# Altium project NANORACK_PHOTODIODE.PrjPcb
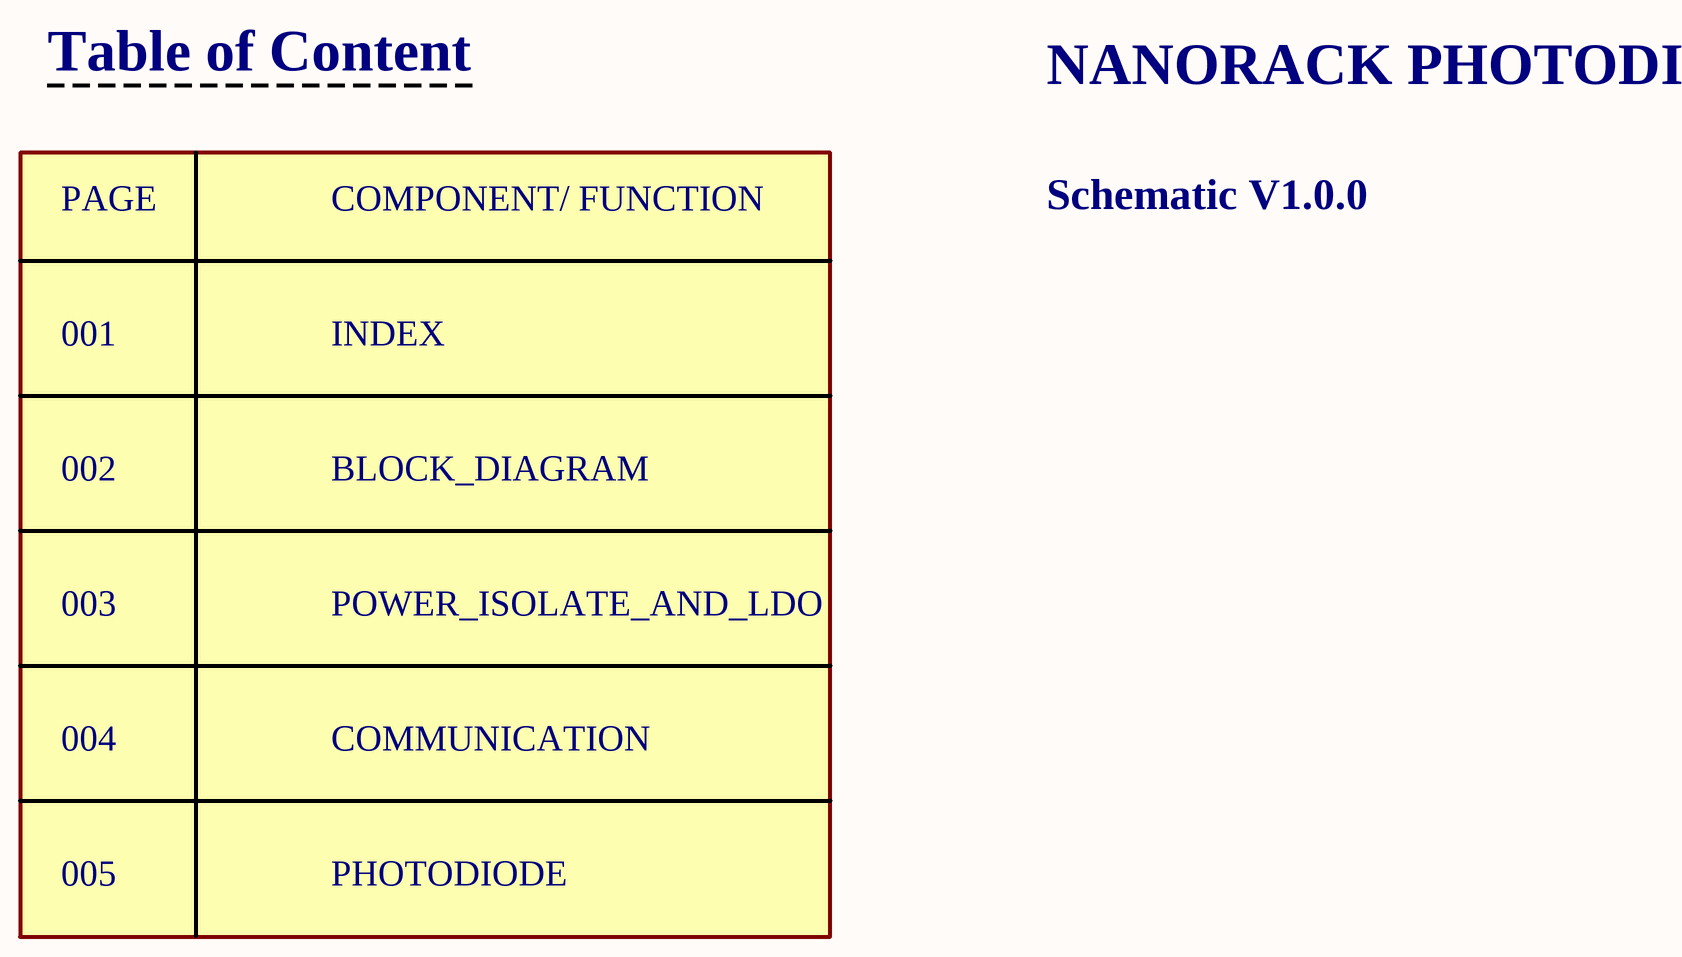
[diagram p0: INDEX.SchDoc]
5 sheets, 134 parts. Net scope: global (net labels, ports and power ports of the same name join across sheets).
Board file: PHOTODIODE_FIX.PcbDoc
Sheets:
  INDEX.SchDoc
  BLOCK_DIAGRAM.SchDoc
  POWER_ISOLATE_AND_LDO.SchDoc
  COMMUNICATION.SchDoc
  PHOTODIODE.SchDoc

## Sheet INDEX.SchDoc
size 420 x 297 mm; SheetNumber: 1; SheetTotal: 5

### Notes on the sheet
- Table of Content
- NANORACK PHOTODIODE
- PAGE
- COMPONENT/ FUNCTION
- Schematic V1.0.0
- 001
- INDEX
- 002
- BLOCK_DIAGRAM
- 003
- POWER_ISOLATE_AND_LDO
- 004
- COMMUNICATION
- 005
- PHOTODIODE
- Project:
- BEE-PC1
- Sub-system:
- Design by:
- Hung Nguyen D.
- Bao Bui Q.
- Sheet title:
- Sheet
- A3
- of
- Checked by:
- Approved by:
- Vu Pham
- Revision:
- Document No:
- V1.0.0
- Size:
- Date:

## Sheet BLOCK_DIAGRAM.SchDoc
size 420 x 297 mm; SheetNumber: 2; SheetTotal: 5

### Notes on the sheet
- Project:
- BEE-PC1
- Sub-system:
- Design by:
- Hung Nguyen D.
- Bao Bui Q.
- Sheet title:
- Sheet
- A3
- of
- Checked by:
- Approved by:
- Vu Pham
- Revision:
- Document No:
- V1.0.0
- Size:
- Date:
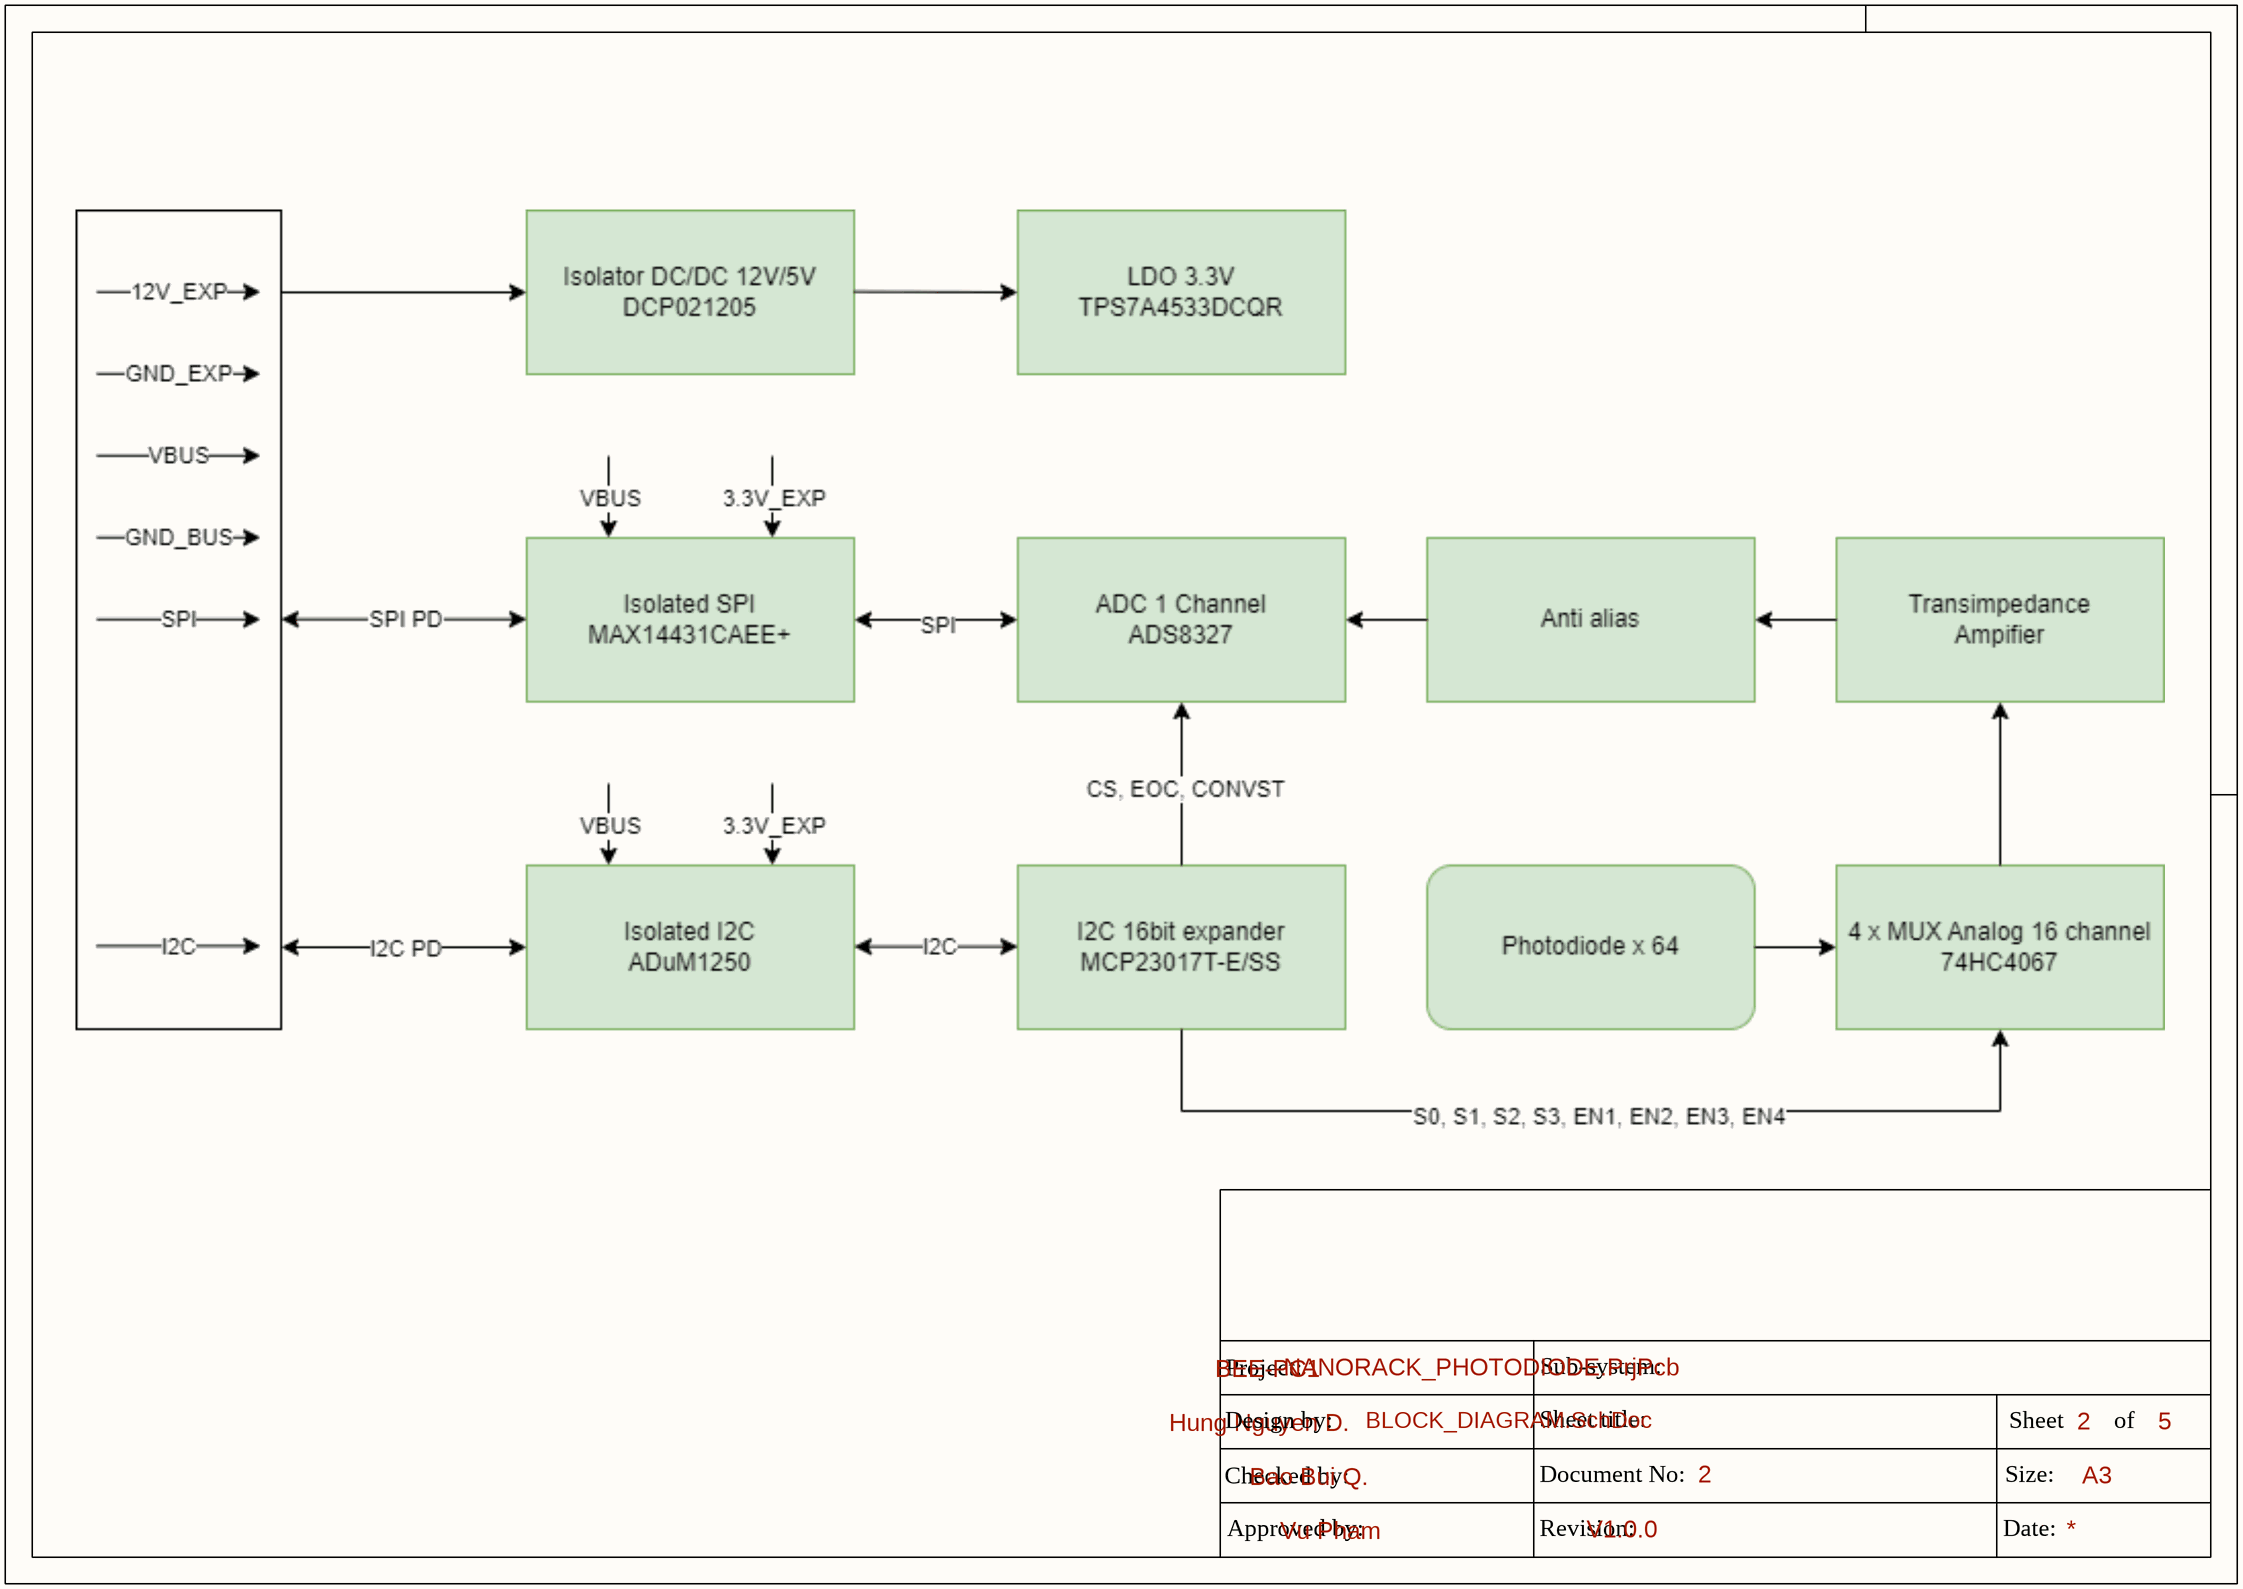
[diagram p1: BLOCK_DIAGRAM.SchDoc]

## Sheet POWER_ISOLATE_AND_LDO.SchDoc
size 420 x 297 mm; SheetNumber: 3; SheetTotal: 5
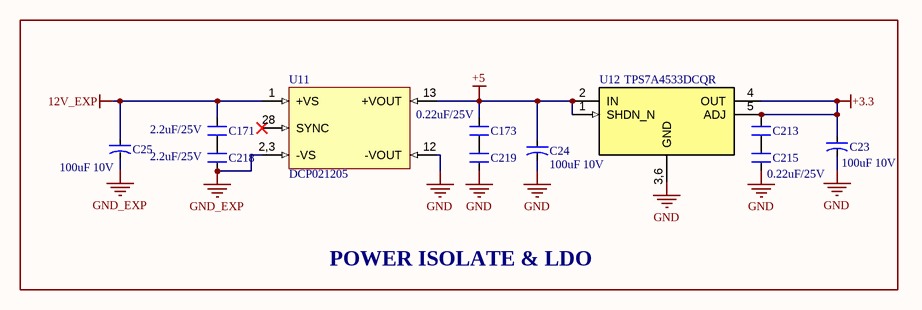
[diagram p2: POWER_ISOLATE_AND_LDO.SchDoc]

### Parts
C23  100uF 10V  [CAP_TANT_1206]
C24  100uF 10V  [CAP_TANT_1206]
C25  100uF 10V  [CAP_TANT_1206]
C171  2.2uF/25V  [SM-0603]
C173  0.22uF/25V  [SM-0603]
C213  0.22uF/25V  [SM-0603]  (value not drawn)
C215  0.22uF/25V  [SM-0603]
C218  2.2uF/25V  [SM-0603]
C219  0.22uF/25V  [SM-0603]  (value not drawn)
U11  DCP021205  [DCP02]
U12  TPS7A4533DCQR  [SOT223-6]

### Blocks framed on the sheet
POWER ISOLATE & LDO: C23-C25 C171 C173 C213 C215 C218 C219 U11 U12

### Nets
12V_EXP: C25.1 C171.2 U11.1(+VS)
+3.3: C23.1 C213.2 U12.4(OUT) U12.5(ADJ)
+5: C24.1 C173.2 U11.13(+VOUT) U12.1(SHDN_N) U12.2(IN)
GND: C23.2 C24.2 C215.1 C219.1 U11.12(-VOUT) U12.3,6(GND)
GND_EXP: C25.2 C218.1 U11.2,3(-VS)
NetC171_1: C171.1 C218.2
NetC173_1: C173.1 C219.2
NetC213_1: C213.1 C215.2

Not connected (* = marked no-connect by the designer): U11 28(SYNC)*

### Notes on the sheet
- Project:
- BEE-PC1
- Sub-system:
- Design by:
- Hung Nguyen D.
- Bao Bui Q.
- Sheet title:
- Sheet
- A3
- of
- Checked by:
- Approved by:
- Vu Pham
- Revision:
- Document No:
- V1.0.0
- Size:
- Date:

### Library data of the parts
C23-C25 = CN-ALU-SMD: Polarized Capacitor (Axial); Published: 8-Jun-2000; LatestRevisionDate: 17-Jul-2002; LatestRevisionNote: Re-released for DXP Platform.; PackageReference: POLAR0.8; Publisher: Altium Limited
C171 C173 C213 C215 C218 C219 = CM: 0603; Value: 103
U11 = PWR_ISO_DCP02
U12 = TPS7A4533DCQR: IC REG LINEAR 3.3V 1.5A SOT223-6

## Sheet COMMUNICATION.SchDoc
size 420 x 297 mm; SheetNumber: 4; SheetTotal: 5
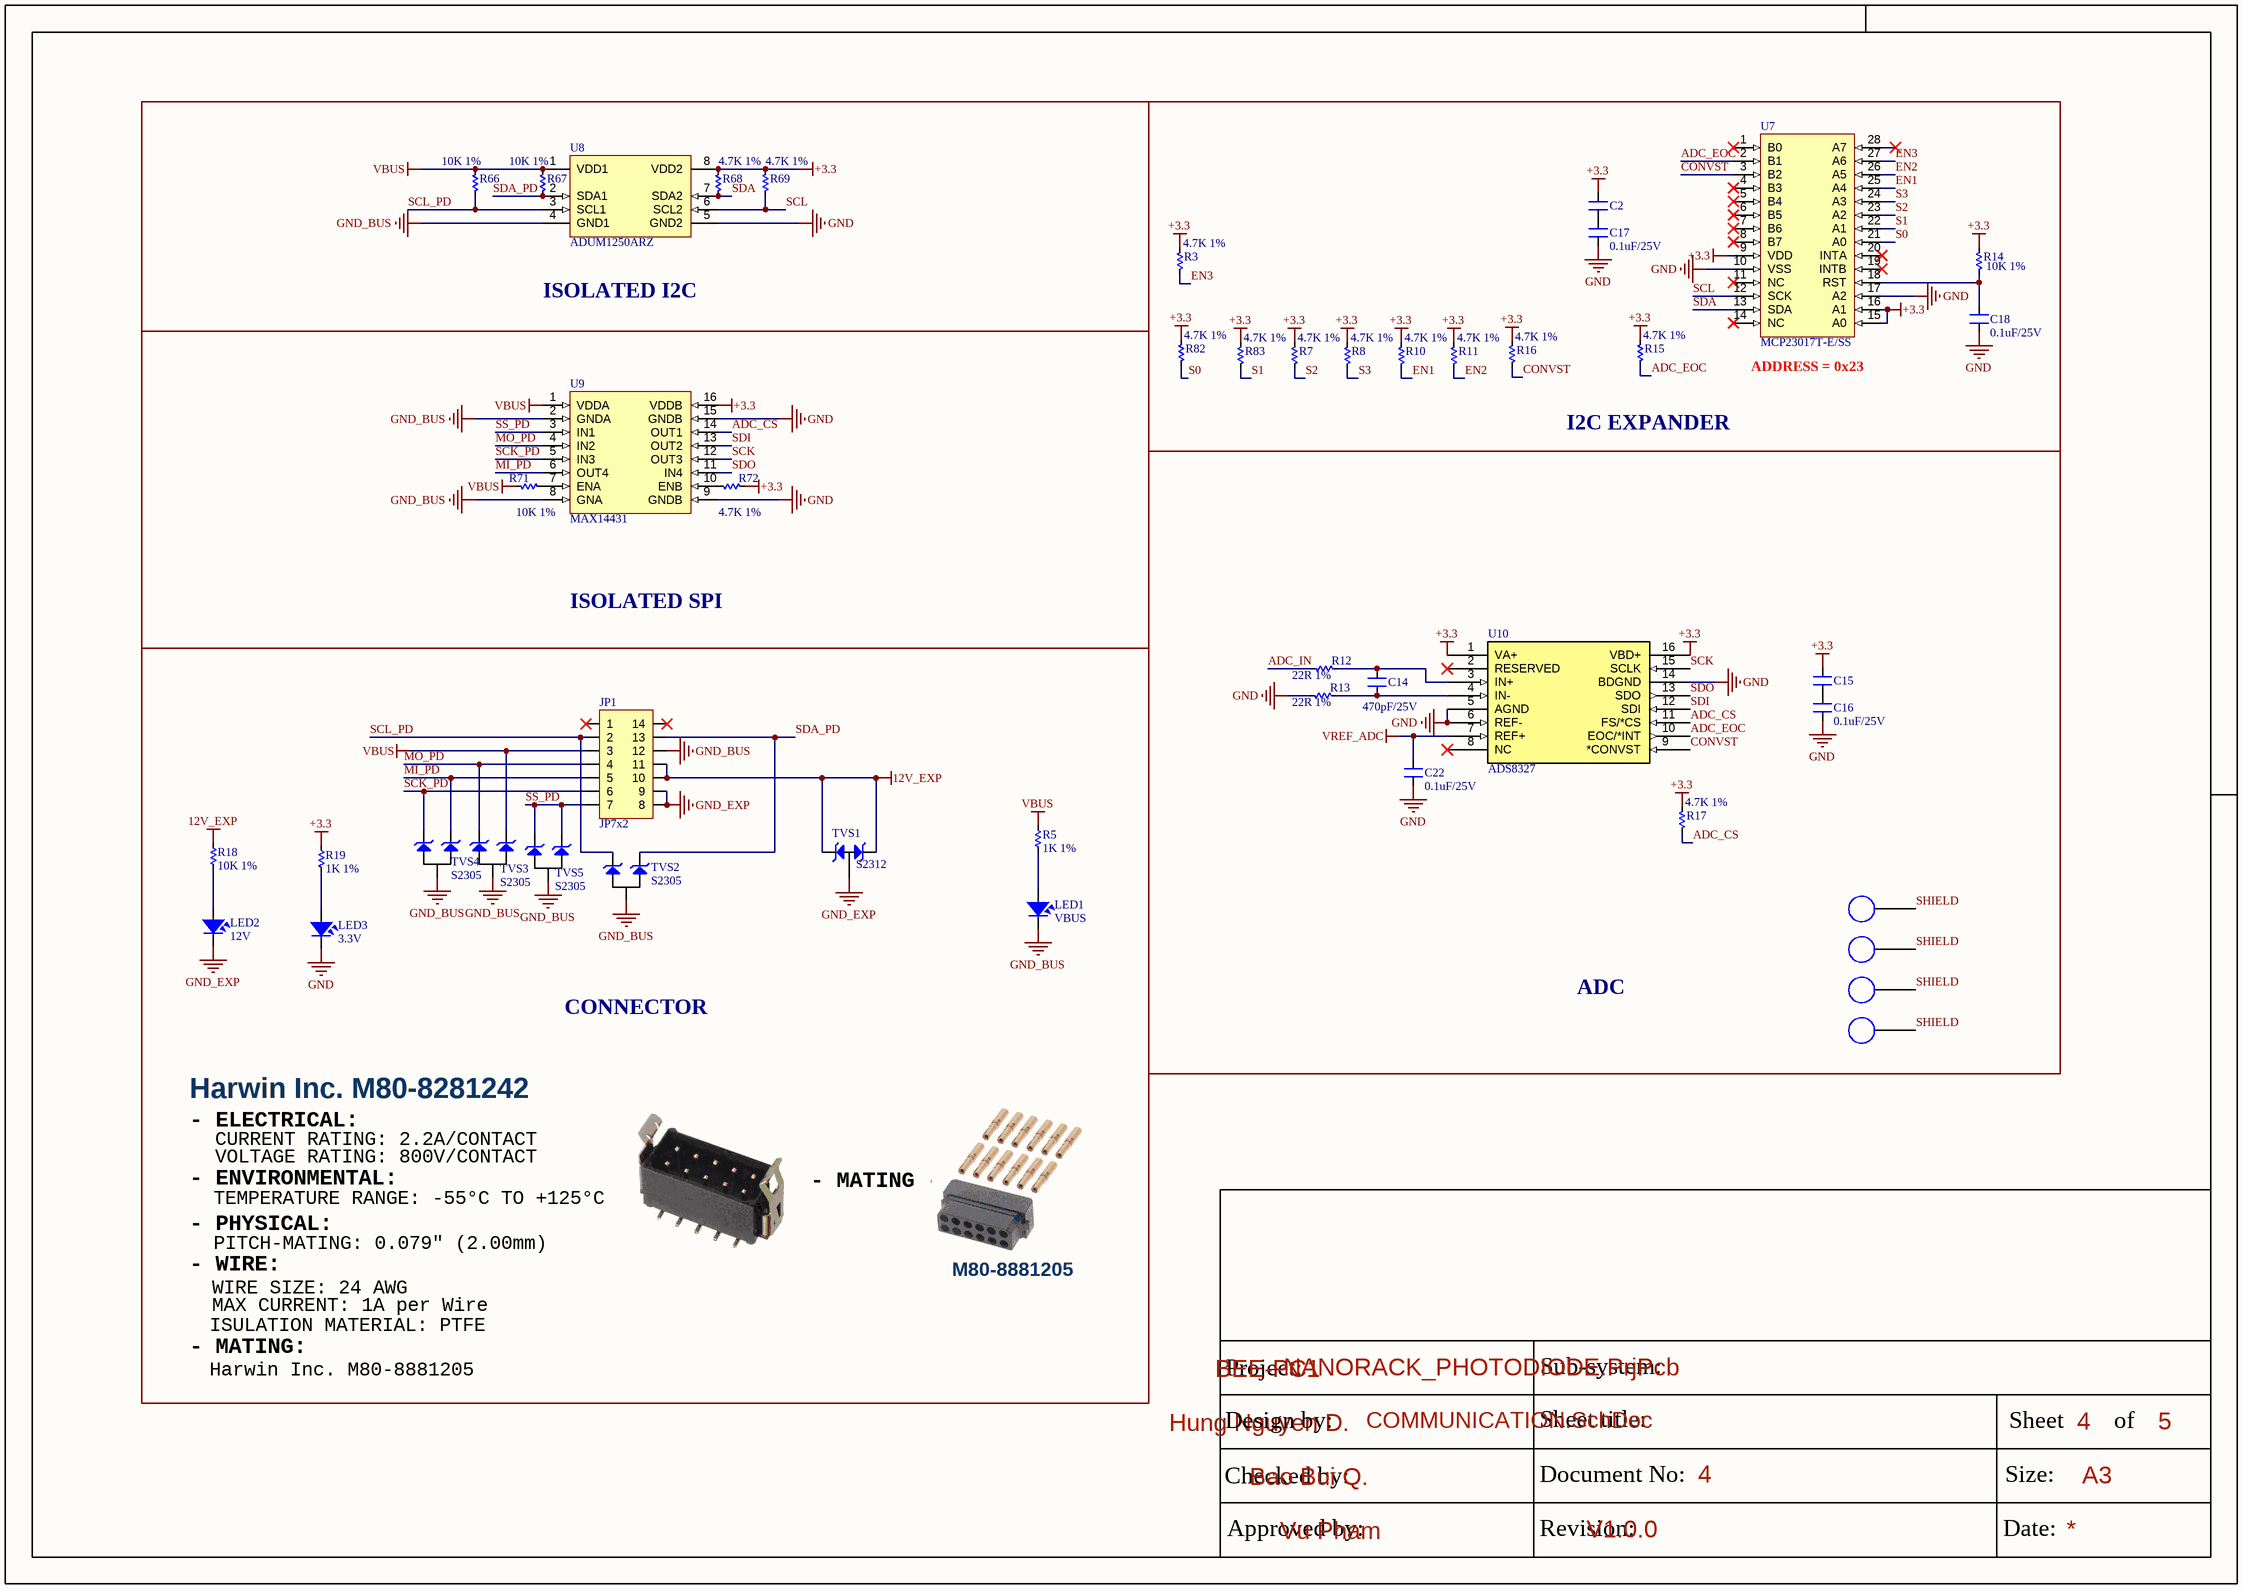
[diagram p3: COMMUNICATION.SchDoc]

### Parts
C2  0.1uF/25V  [SM-0603]  (value not drawn)
C14  470pF/25V  [SM-0603]
C15  0.1uF/25V  [SM-0603]  (value not drawn)
C16  0.1uF/25V  [SM-0603]
C17  0.1uF/25V  [SM-0603]
C18  0.1uF/25V  [SM-0603]
C22  0.1uF/25V  [SM-0603]
H1  M3  [M3]  (value not drawn)
H2  M3  [M3]  (value not drawn)
H3  M3  [M3]  (value not drawn)
H4  M3  [M3]  (value not drawn)
JP1  JP7x2  [M80-8281442]
LED1  VBUS  [GREENLED_0603]
LED2  12V  [GREENLED_0603]
LED3  3.3V  [GREENLED_0603]
R3  4.7K 1%  [RES-SMD-0603]
R5  1K 1%  [RES-SMD-0603]
R7  4.7K 1%  [RES-SMD-0603]
R8  4.7K 1%  [RES-SMD-0603]
R10  4.7K 1%  [RES-SMD-0603]
R11  4.7K 1%  [RES-SMD-0603]
R12  22R 1%  [RES-SMD-0603]
R13  22R 1%  [RES-SMD-0603]
R14  10K 1%  [RES-SMD-0603]
R15  4.7K 1%  [RES-SMD-0603]
R16  4.7K 1%  [RES-SMD-0603]
R17  4.7K 1%  [RES-SMD-0603]
R18  10K 1%  [RES-SMD-0603]
R19  1K 1%  [RES-SMD-0603]
R66  10K 1%  [RES-SMD-0603]
R67  10K 1%  [RES-SMD-0603]
R68  4.7K 1%  [RES-SMD-0603]
R69  4.7K 1%  [RES-SMD-0603]
R71  10K 1%  [RES-SMD-0603]
R72  4.7K 1%  [RES-SMD-0603]
R82  4.7K 1%  [RES-SMD-0603]
R83  4.7K 1%  [RES-SMD-0603]
TVS1  S2312  [SOT23-123]
TVS2  S2305  [SOT23-123]
TVS3  S2305  [SOT23-123]
TVS4  S2305  [SOT23-123]
TVS5  S2305  [SOT23-123]
U7  MCP23017T-E/SS  [SSOP28]
U8  ADUM1250ARZ  [SO8]
U9  MAX14431  [MAX14431]
U10  ADS8327  [TSSOP16]

### Blocks framed on the sheet
ISOLATED I2C: R66-R69 U8
I2C EXPANDER: C2 C17 C18 R3 R7 R8 R10 R11 R14-R16 R82 R83 U7
ISOLATED SPI: R71 R72 U9
ADC: C14-C16 C22 H1-H4 R12 R13 R17 U10
Harwin Inc. M80-8281242: JP1 LED1-LED3 R5 R18 R19 TVS1-TVS5

### Nets
12V_EXP: JP1.10 JP1.11 R18.2 TVS1.1 TVS1.3
+3.3: C2.2 C15.2 R3.2 R7.2 R8.2 R10.2 R11.2 R14.2 R15.2 R16.2 R17.2 R19.2 R68.2 R69.2 R72.1 R82.2 R83.2 U7.9(VDD) U7.15(A0) U7.16(A1) U8.8(VDD2) U9.16(VDDB) U10.1(VA+) U10.16(VBD+)
GND: C16.1 C17.1 C18.1 C22.1 LED3.2 R13.2 U7.10(VSS) U7.17(A2) U8.5(GND2) U9.9(GNDB) U9.15(GNDB) U10.5(AGND) U10.6(REF-) U10.14(BDGND)
GND_BUS: JP1.12 LED1.2 TVS2.2 TVS3.2 TVS4.2 TVS5.2 U8.4(GND1) U9.2(GNDA) U9.8(GNA)
GND_EXP: JP1.8 JP1.9 LED2.2 TVS1.2
VBUS: JP1.3 R5.2 R66.2 R67.2 R71.2 TVS3.3 U8.1(VDD1) U9.1(VDDA)
VREF_ADC: C22.2 U10.7(REF+)
ADC_CS: R17.1 U9.14(OUT1) U10.11(FS/*CS)
ADC_EOC: R15.1 U7.2(B1) U10.10(EOC/*INT)
ADC_IN: R12.2
CONVST: R16.1 U7.3(B2) U10.9(*CONVST)
EN1: R10.1 U7.25(A4)
EN2: R11.1 U7.26(A5)
EN3: R3.1 U7.27(A6)
MI_PD: JP1.5 TVS4.3 U9.6(OUT4)
MO_PD: JP1.4 TVS3.1 U9.4(IN2)
S0: R82.1 U7.21(A0)
S1: R83.1 U7.22(A1)
S2: R7.1 U7.23(A2)
S3: R8.1 U7.24(A3)
SCK: U9.12(OUT3) U10.15(SCLK)
SCK_PD: JP1.6 TVS4.1 U9.5(IN3)
SCL: R69.1 U7.12(SCK) U8.6(SCL2)
SCL_PD: JP1.2 R66.1 TVS2.1 U8.3(SCL1)
SDA: R68.1 U7.13(SDA) U8.7(SDA2)
SDA_PD: JP1.13 R67.1 TVS2.3 U8.2(SDA1)
SDI: U9.13(OUT2) U10.12(SDI)
SDO: U9.11(IN4) U10.13(SDO)
SHIELD: H1.1 H2.1 H3.1 H4.1
SS_PD: JP1.7 TVS5.1 TVS5.3 U9.3(IN1)
NetC2_1: C2.1 C17.2
NetC14_1: C14.1 R13.1 U10.4(IN-)
NetC14_2: C14.2 R12.1 U10.3(IN+)
NetC15_1: C15.1 C16.2
NetC18_2: C18.2 R14.1 U7.18(RST)
NetLED1_1: LED1.1 R5.1
NetLED2_1: LED2.1 R18.1
NetLED3_1: LED3.1 R19.1
NetR71_1: R71.1 U9.7(ENA)
NetR72_2: R72.2 U9.10(ENB)

Not connected (* = marked no-connect by the designer): JP1 1* 14*; U7 1(B0)* 4(B3)* 5(B4)* 6(B5)* 7(B6)* 8(B7)* 11(NC)* 14(NC)* 19(INTB)* 20(INTA)* 28(A7)*; U10 2(RESERVED)* 8(NC)*

### Notes on the sheet
- (near U7) ADDRESS = 0x23
- CONNECTOR
- - ELECTRICAL:
- - ENVIRONMENTAL:
- TEMPERATURE RANGE: -55°C TO +125°C
- CURRENT RATING: 2.2A/CONTACT
- VOLTAGE RATING: 800V/CONTACT
- - MATING -
- - PHYSICAL:
- - WIRE:
- PITCH-MATING: 0.079" (2.00mm)
- ISULATION MATERIAL: PTFE
- WIRE SIZE: 24 AWG
- MAX CURRENT: 1A per Wire
- M80-8881205
- - MATING:
- Harwin Inc. M80-8881205
- Project:
- BEE-PC1
- Sub-system:
- Design by:
- Hung Nguyen D.
- Bao Bui Q.
- Sheet title:
- Sheet
- A3
- of
- Checked by:
- Approved by:
- Vu Pham
- Revision:
- Document No:
- V1.0.0
- Size:
- Date:

### Library data of the parts
C2 C14-C18 C22 = CM: 0603; Value: 103
JP1 = JP7x2: WR-PHD 2.54 mm Dual Socket Header; Manufacturer: W¨¹rth Elektronik eiSos GmbH; partNo: 61301421821; ComponentLink1 Description: Manufacturer; ComponentLink2 Description: Datasheet; NoPins: 14; Created Date: 29 March 2013; ComponentLink1URL: http://www.we-online.com; ComponentLink2URL: http://katalog.we-online.de/em/datasheet/6130xx21821.pdf; Created by: Karrer Zheng
LED1-LED3 = LED SMD: Value: LED 3 - 5 ly 2 Colour
R3 R5 R7 R8 R10-R19 R66-R69 R71 R72 R82 R83 = Res-SMD: 0603; Manufacturer: Generic Components; Class: Passive; Published: 08/06/2000; Publisher: Altium Hobart Technology Centre
TVS1 = S2315: TVS DIODE 12VWM 19VC SOT23, P/N:  S2312
TVS2-TVS5 = S2303: TVS DIODE 5VWM 10.8VC SOT23, P/N: / S2305
U7 = MCP23017
U8 = ADUM1250
U9 = MAX14431: MAX14431CAEE+
U10 = ADS8327: IC ADC 16BIT SAR 16TSSOP; Supplier 1: Mouser; Supplier Part Number 1: 595-ADS8327IPW

## Sheet PHOTODIODE.SchDoc
size 420 x 297 mm; SheetNumber: 5; SheetTotal: 5
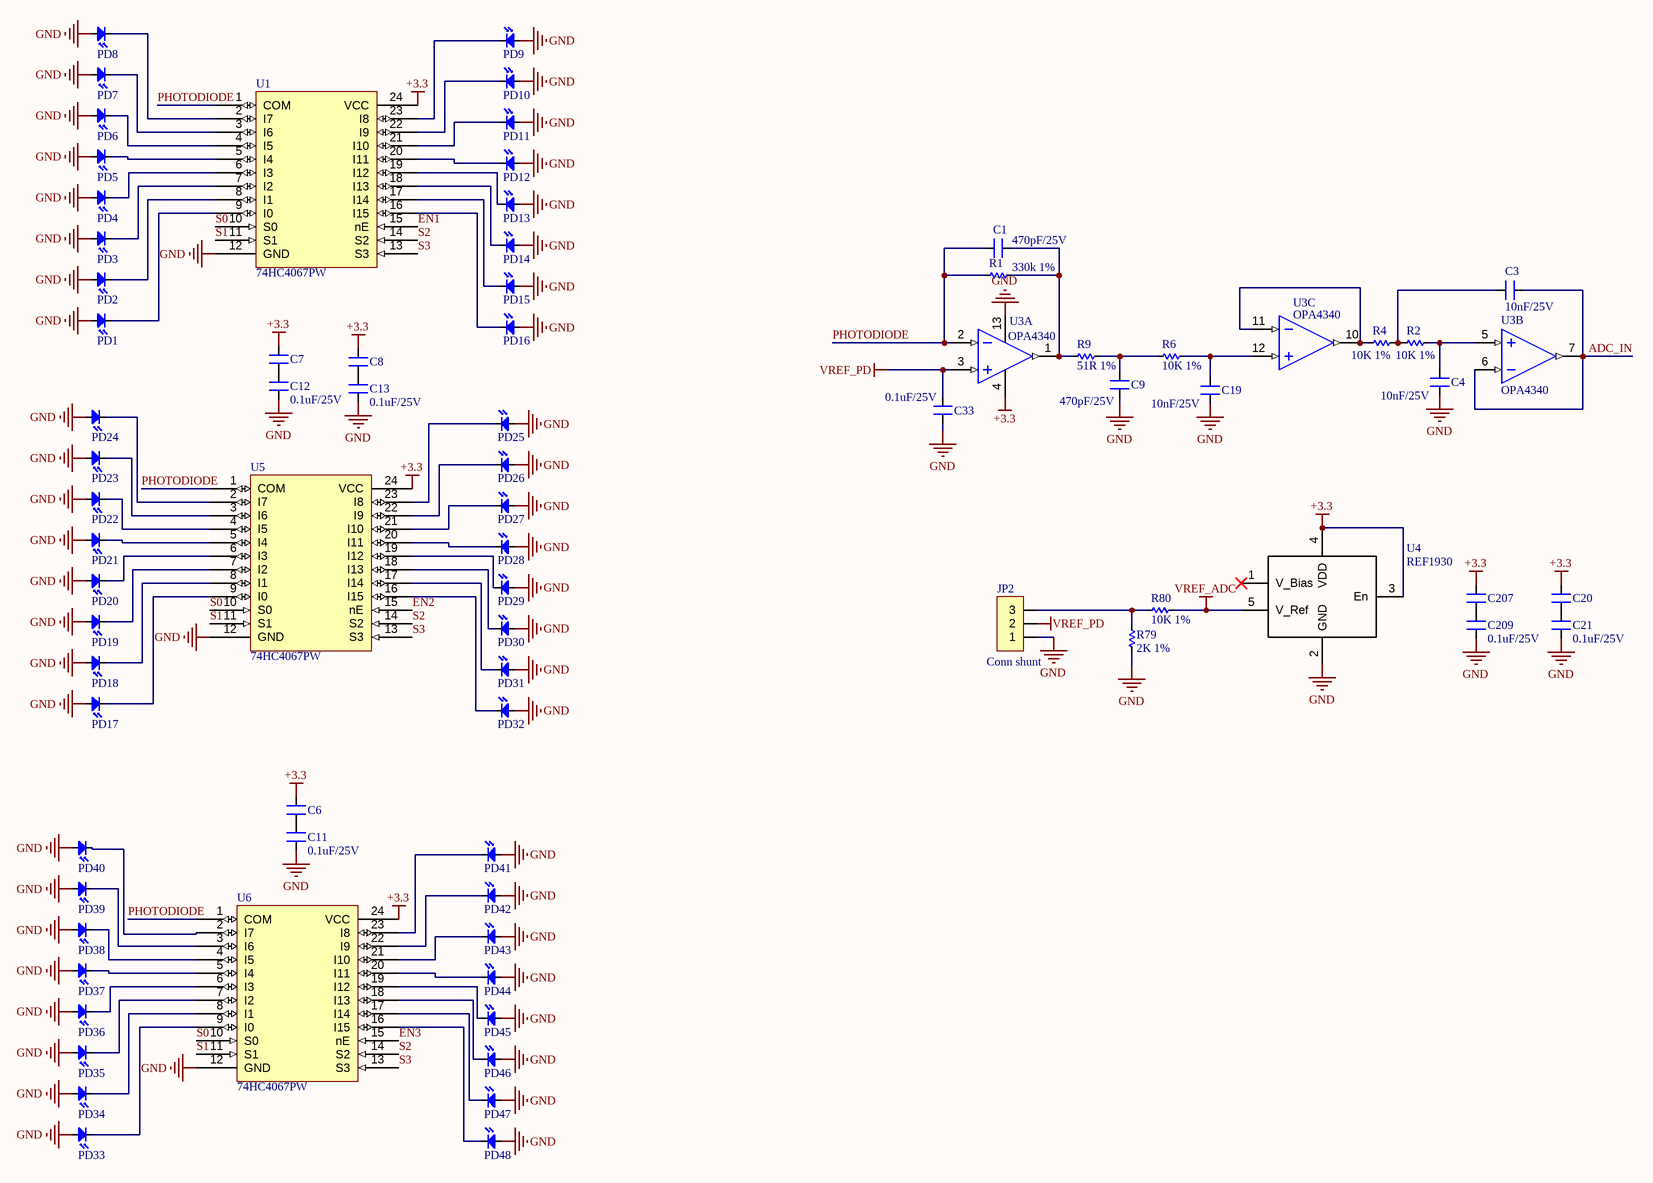
[diagram p4: PHOTODIODE.SchDoc]

### Parts
C1  470pF/25V  [SM-0603]
C3  10nF/25V  [SM-0603]
C4  10nF/25V  [SM-0603]
C6  0.1uF/25V  [SM-0603]  (value not drawn)
C7  0.1uF/25V  [SM-0603]  (value not drawn)
C8  0.1uF/25V  [SM-0603]  (value not drawn)
C9  470pF/25V  [SM-0603]
C11  0.1uF/25V  [SM-0603]
C12  0.1uF/25V  [SM-0603]
C13  0.1uF/25V  [SM-0603]
C19  10nF/25V  [SM-0603]
C20  0.1uF/25V  [SM-0603]  (value not drawn)
C21  0.1uF/25V  [SM-0603]
C33  0.1uF/25V  [SM-0603]
C207  0.1uF/25V  [SM-0603]  (value not drawn)
C209  0.1uF/25V  [SM-0603]
JP2  Conn shunt  [M50-3930342]
PD1  Photodiode  [VEMD5080X01]  (value not drawn)
PD2  Photodiode  [VEMD5080X01]  (value not drawn)
PD3  Photodiode  [VEMD5080X01]  (value not drawn)
PD4  Photodiode  [VEMD5080X01]  (value not drawn)
PD5  Photodiode  [VEMD5080X01]  (value not drawn)
PD6  Photodiode  [VEMD5080X01]  (value not drawn)
PD7  Photodiode  [VEMD5080X01]  (value not drawn)
PD8  Photodiode  [VEMD5080X01]  (value not drawn)
PD9  Photodiode  [VEMD5080X01]  (value not drawn)
PD10  Photodiode  [VEMD5080X01]  (value not drawn)
PD11  Photodiode  [VEMD5080X01]  (value not drawn)
PD12  Photodiode  [VEMD5080X01]  (value not drawn)
PD13  Photodiode  [VEMD5080X01]  (value not drawn)
PD14  Photodiode  [VEMD5080X01]  (value not drawn)
PD15  Photodiode  [VEMD5080X01]  (value not drawn)
PD16  Photodiode  [VEMD5080X01]  (value not drawn)
PD17  Photodiode  [VEMD5080X01]  (value not drawn)
PD18  Photodiode  [VEMD5080X01]  (value not drawn)
PD19  Photodiode  [VEMD5080X01]  (value not drawn)
PD20  Photodiode  [VEMD5080X01]  (value not drawn)
PD21  Photodiode  [VEMD5080X01]  (value not drawn)
PD22  Photodiode  [VEMD5080X01]  (value not drawn)
PD23  Photodiode  [VEMD5080X01]  (value not drawn)
PD24  Photodiode  [VEMD5080X01]  (value not drawn)
PD25  Photodiode  [VEMD5080X01]  (value not drawn)
PD26  Photodiode  [VEMD5080X01]  (value not drawn)
PD27  Photodiode  [VEMD5080X01]  (value not drawn)
PD28  Photodiode  [VEMD5080X01]  (value not drawn)
PD29  Photodiode  [VEMD5080X01]  (value not drawn)
PD30  Photodiode  [VEMD5080X01]  (value not drawn)
PD31  Photodiode  [VEMD5080X01]  (value not drawn)
PD32  Photodiode  [VEMD5080X01]  (value not drawn)
PD33  Photodiode  [VEMD5080X01]  (value not drawn)
PD34  Photodiode  [VEMD5080X01]  (value not drawn)
PD35  Photodiode  [VEMD5080X01]  (value not drawn)
PD36  Photodiode  [VEMD5080X01]  (value not drawn)
PD37  Photodiode  [VEMD5080X01]  (value not drawn)
PD38  Photodiode  [VEMD5080X01]  (value not drawn)
PD39  Photodiode  [VEMD5080X01]  (value not drawn)
PD40  Photodiode  [VEMD5080X01]  (value not drawn)
PD41  Photodiode  [VEMD5080X01]  (value not drawn)
PD42  Photodiode  [VEMD5080X01]  (value not drawn)
PD43  Photodiode  [VEMD5080X01]  (value not drawn)
PD44  Photodiode  [VEMD5080X01]  (value not drawn)
PD45  Photodiode  [VEMD5080X01]  (value not drawn)
PD46  Photodiode  [VEMD5080X01]  (value not drawn)
PD47  Photodiode  [VEMD5080X01]  (value not drawn)
PD48  Photodiode  [VEMD5080X01]  (value not drawn)
R1  330k 1%  [RES-SMD-0603]
R2  10K 1%  [RES-SMD-0603]
R4  10K 1%  [RES-SMD-0603]
R6  10K 1%  [RES-SMD-0603]
R9  51R 1%  [RES-SMD-0603]
R79  2K 1%  [RES-SMD-0603]
R80  10K 1%  [RES-SMD-0603]
U1  74HC4067PW  [TSSOP24]
U3  OPA4340  [SSOP16]  (parts A,B,C of 4)
U4  REF1930  [SOT23-5]
U5  74HC4067PW  [TSSOP24]
U6  74HC4067PW  [TSSOP24]

### Nets
+3.3: C6.2 C7.2 C8.2 C20.2 C207.2 U1.24(VCC) U3.4(+V) U4.3(En) U4.4(VDD) U5.24(VCC) U6.24(VCC)
GND: C4.1 C9.1 C11.1 C12.1 C13.1 C19.1 C21.1 C33.1 C209.1 JP2.1 PD1.1(A) PD2.1(A) PD3.1(A) PD4.1(A) PD5.1(A) PD6.1(A) PD7.1(A) PD8.1(A) PD9.1(A) PD10.1(A) PD11.1(A) PD12.1(A) PD13.1(A) PD14.1(A) PD15.1(A) PD16.1(A) PD17.1(A) PD18.1(A) PD19.1(A) PD20.1(A) PD21.1(A) PD22.1(A) PD23.1(A) PD24.1(A) PD25.1(A) PD26.1(A) PD27.1(A) PD28.1(A) PD29.1(A) PD30.1(A) PD31.1(A) PD32.1(A) PD33.1(A) PD34.1(A) PD35.1(A) PD36.1(A) PD37.1(A) PD38.1(A) PD39.1(A) PD40.1(A) PD41.1(A) PD42.1(A) PD43.1(A) PD44.1(A) PD45.1(A) PD46.1(A) PD47.1(A) PD48.1(A) R79.1 U1.12(GND) U3.13(-V) U4.2(GND) U5.12(GND) U6.12(GND)
VREF_ADC: R80.1 U4.5(V_Ref)
VREF_PD: C33.2 JP2.2 U3.3(IN+)
ADC_IN: C3.1 U3.6(IN-) U3.7(OUT)
EN1: U1.15(nE)
EN2: U5.15(nE)
EN3: U6.15(nE)
PHOTODIODE: C1.1 R1.1 U1.1(COM) U3.2(IN-) U5.1(COM) U6.1(COM)
S0: U1.10(S0) U5.10(S0) U6.10(S0)
S1: U1.11(S1) U5.11(S1) U6.11(S1)
S2: U1.14(S2) U5.14(S2) U6.14(S2)
S3: U1.13(S3) U5.13(S3) U6.13(S3)
NetC1_2: C1.2 R1.2 R9.1 U3.1(OUT)
NetC3_2: C3.2 R2.1 R4.2
NetC4_2: C4.2 R2.2 U3.5(IN+)
NetC6_1: C6.1 C11.2
NetC7_1: C7.1 C12.2
NetC8_1: C8.1 C13.2
NetC9_2: C9.2 R6.1 R9.2
NetC19_2: C19.2 R6.2 U3.12(IN+)
NetC20_1: C20.1 C21.2
NetC207_1: C207.1 C209.2
NetJP2_3: JP2.3 R79.2 R80.2
NetPD1_2: PD1.2(K) U1.9(I0)
NetPD2_2: PD2.2(K) U1.8(I1)
NetPD3_2: PD3.2(K) U1.7(I2)
NetPD4_2: PD4.2(K) U1.6(I3)
NetPD5_2: PD5.2(K) U1.5(I4)
NetPD6_2: PD6.2(K) U1.4(I5)
NetPD7_2: PD7.2(K) U1.3(I6)
NetPD8_2: PD8.2(K) U1.2(I7)
NetPD9_2: PD9.2(K) U1.23(I8)
NetPD10_2: PD10.2(K) U1.22(I9)
NetPD11_2: PD11.2(K) U1.21(I10)
NetPD12_2: PD12.2(K) U1.20(I11)
NetPD13_2: PD13.2(K) U1.19(I12)
NetPD14_2: PD14.2(K) U1.18(I13)
NetPD15_2: PD15.2(K) U1.17(I14)
NetPD16_2: PD16.2(K) U1.16(I15)
NetPD17_2: PD17.2(K) U5.9(I0)
NetPD18_2: PD18.2(K) U5.8(I1)
NetPD19_2: PD19.2(K) U5.7(I2)
NetPD20_2: PD20.2(K) U5.6(I3)
NetPD21_2: PD21.2(K) U5.5(I4)
NetPD22_2: PD22.2(K) U5.4(I5)
NetPD23_2: PD23.2(K) U5.3(I6)
NetPD24_2: PD24.2(K) U5.2(I7)
NetPD25_2: PD25.2(K) U5.23(I8)
NetPD26_2: PD26.2(K) U5.22(I9)
NetPD27_2: PD27.2(K) U5.21(I10)
NetPD28_2: PD28.2(K) U5.20(I11)
NetPD29_2: PD29.2(K) U5.19(I12)
NetPD30_2: PD30.2(K) U5.18(I13)
NetPD31_2: PD31.2(K) U5.17(I14)
NetPD32_2: PD32.2(K) U5.16(I15)
NetPD33_2: PD33.2(K) U6.9(I0)
NetPD34_2: PD34.2(K) U6.8(I1)
NetPD35_2: PD35.2(K) U6.7(I2)
NetPD36_2: PD36.2(K) U6.6(I3)
NetPD37_2: PD37.2(K) U6.5(I4)
NetPD38_2: PD38.2(K) U6.4(I5)
NetPD39_2: PD39.2(K) U6.3(I6)
NetPD40_2: PD40.2(K) U6.2(I7)
NetPD41_2: PD41.2(K) U6.23(I8)
NetPD42_2: PD42.2(K) U6.22(I9)
NetPD43_2: PD43.2(K) U6.21(I10)
NetPD44_2: PD44.2(K) U6.20(I11)
NetPD45_2: PD45.2(K) U6.19(I12)
NetPD46_2: PD46.2(K) U6.18(I13)
NetPD47_2: PD47.2(K) U6.17(I14)
NetPD48_2: PD48.2(K) U6.16(I15)
NetR4_1: R4.1 U3.10(OUT) U3.11(IN-)

Not connected (* = marked no-connect by the designer): U4 1(V_Bias)*

### Notes on the sheet
- Project:
- BEE-PC1
- Sub-system:
- Design by:
- Hung Nguyen D.
- Bao Bui Q.
- Sheet title:
- Sheet
- A3
- of
- Checked by:
- Approved by:
- Vu Pham
- Revision:
- Document No:
- V1.0.0
- Size:
- Date:

### Library data of the parts
C1 C3 C4 C6-C9 C11-C13 C19-C21 C33 C207 C209 = CM: 0603; Value: 103
JP2 = JP3: WR-PHD 2.54 mm Angled Socket Header; Manufacturer: W¨¹rth Elektronik eiSos GmbH; partNo: 613003143121; ComponentLink1 Description: Manufacturer; ComponentLink2 Description: Datasheet; NoPins: 03; Created Date: 29 March 2013; ComponentLink1URL: http://www.we-online.com; ComponentLink2URL: http://katalog.we-online.de/em/datasheet/6130xx143121.pdf; Created by: Karrer Zheng
R1 R2 R4 R6 R9 R79 R80 = Res-SMD: as R3 on sheet COMMUNICATION; Published: 08/06/2000; Publisher: Altium Hobart Technology Centre
U1 U5 U6 = 74HC4067PW: TSSOP24
U3 = OPA4340: IC CMOS 4 CIRCUIT 16SSOP; Supplier 1: Mouser; Supplier Part Number 1: 595-OPA4340UA/2K5
U4 = REF19xx: REF1941AIDDCT

## Nets that join several sheets
12V_EXP: POWER_ISOLATE_AND_LDO (C25.1 C171.2 U11.1), COMMUNICATION (5 pins)
+3.3: POWER_ISOLATE_AND_LDO (C23.1 C213.2 U12.4 U12.5), COMMUNICATION (24 pins), PHOTODIODE (11 pins)
GND: POWER_ISOLATE_AND_LDO (6 pins), COMMUNICATION (14 pins), PHOTODIODE (64 pins)
GND_EXP: POWER_ISOLATE_AND_LDO (C25.2 C218.1 U11.2,3), COMMUNICATION (JP1.8 JP1.9 LED2.2 TVS1.2)
VREF_ADC: COMMUNICATION (C22.2 U10.7), PHOTODIODE (R80.1 U4.5)
ADC_IN: COMMUNICATION (R12.2), PHOTODIODE (C3.1 U3.6 U3.7)
EN1: COMMUNICATION (R10.1 U7.25), PHOTODIODE (U1.15)
EN2: COMMUNICATION (R11.1 U7.26), PHOTODIODE (U5.15)
EN3: COMMUNICATION (R3.1 U7.27), PHOTODIODE (U6.15)
S0: COMMUNICATION (R82.1 U7.21), PHOTODIODE (U1.10 U5.10 U6.10)
S1: COMMUNICATION (R83.1 U7.22), PHOTODIODE (U1.11 U5.11 U6.11)
S2: COMMUNICATION (R7.1 U7.23), PHOTODIODE (U1.14 U5.14 U6.14)
S3: COMMUNICATION (R8.1 U7.24), PHOTODIODE (U1.13 U5.13 U6.13)